# EAGLE design dodocohedreled (EAGLE 6.5.0)
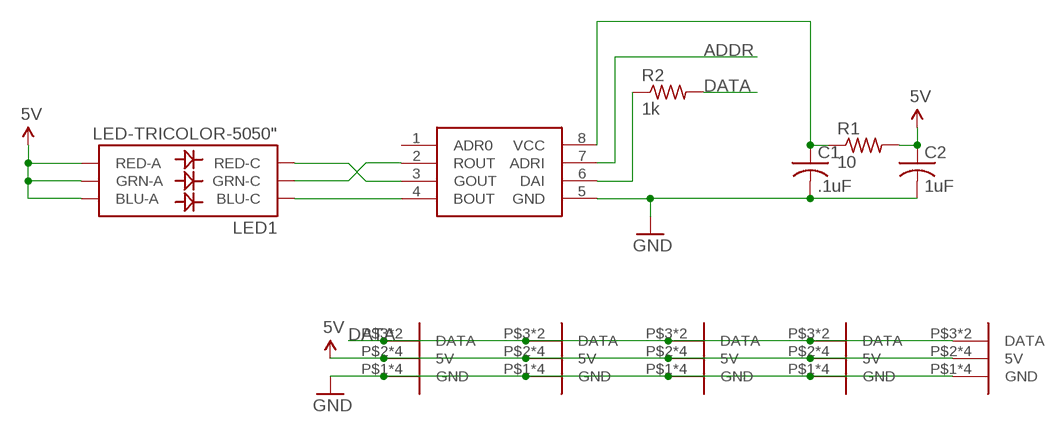
[diagram p0: schematic, sheet 1]

## Parts
C1  .1uF  C-USC0603  [C0603]
C2  1uF  C-USC0603  [C0603]
LED1  LED-TRICOLOR-5050"  [LED-TRICOLOR-5050-FIXED]
R1  10  R-US_R0603  [R0603]
R2  1k  R-US_R0603  [R0603]
U$1  WS2821A  [SOP8]
U$2  D_EDGESLOT  [D_EDGE_SLOT]
U$3  D_EDGESLOT  [D_EDGE_SLOT]
U$4  D_EDGESLOT  [D_EDGE_SLOT]
U$5  D_EDGESLOT  [D_EDGE_SLOT]
U$6  D_EDGESLOT  [D_EDGE_SLOT]

## Nets
5V: C2.1 LED1.4(GRN-A) LED1.5(RED-A) LED1.6(BLU-A) R1.2 U$2.P$2(5V) U$2.P$4(5V) U$2.P$7(5V) U$2.P$9(5V) U$3.P$2(5V) U$3.P$4(5V) U$3.P$7(5V) U$3.P$9(5V) U$4.P$2(5V) U$4.P$4(5V) U$4.P$7(5V) U$4.P$9(5V) U$5.P$2(5V) U$5.P$4(5V) U$5.P$7(5V) U$5.P$9(5V) U$6.P$2(5V) U$6.P$4(5V) U$6.P$7(5V) U$6.P$9(5V)
ADDR: U$1.7(ADRI)
DATA: R2.2 U$2.P$3(DATA) U$2.P$8(DATA) U$3.P$3(DATA) U$3.P$8(DATA) U$4.P$3(DATA) U$4.P$8(DATA) U$5.P$3(DATA) U$5.P$8(DATA) U$6.P$3(DATA) U$6.P$8(DATA)
GND: C1.2 C2.2 U$1.5(GND) U$2.P$1(GND) U$2.P$5(GND) U$2.P$6(GND) U$2.P$10(GND) U$3.P$1(GND) U$3.P$5(GND) U$3.P$6(GND) U$3.P$10(GND) U$4.P$1(GND) U$4.P$5(GND) U$4.P$6(GND) U$4.P$10(GND) U$5.P$1(GND) U$5.P$5(GND) U$5.P$6(GND) U$5.P$10(GND) U$6.P$1(GND) U$6.P$5(GND) U$6.P$6(GND) U$6.P$10(GND)
N$1: LED1.3(GRN-C) U$1.2(ROUT)
N$2: LED1.1(BLU-C) U$1.4(BOUT)
N$3: LED1.2(RED-C) U$1.3(GOUT)
N$6: C1.1 R1.1 U$1.8(VCC)
N$10: R2.1 U$1.6(DAI)
Unconnected: U$1.1(ADR0)

## Library data of the parts
C1 C2 = adafruit:C-US: CAPACITOR, American symbol
LED1 = blinkinlabs:LED-TRICOLOR-5050
R1 R2 = adafruit:R-US_: RESISTOR, American symbol
U$1 = dodocohedreled:WS2821A
U$2-U$6 = dodocohedreled:D_EDGE

## Board
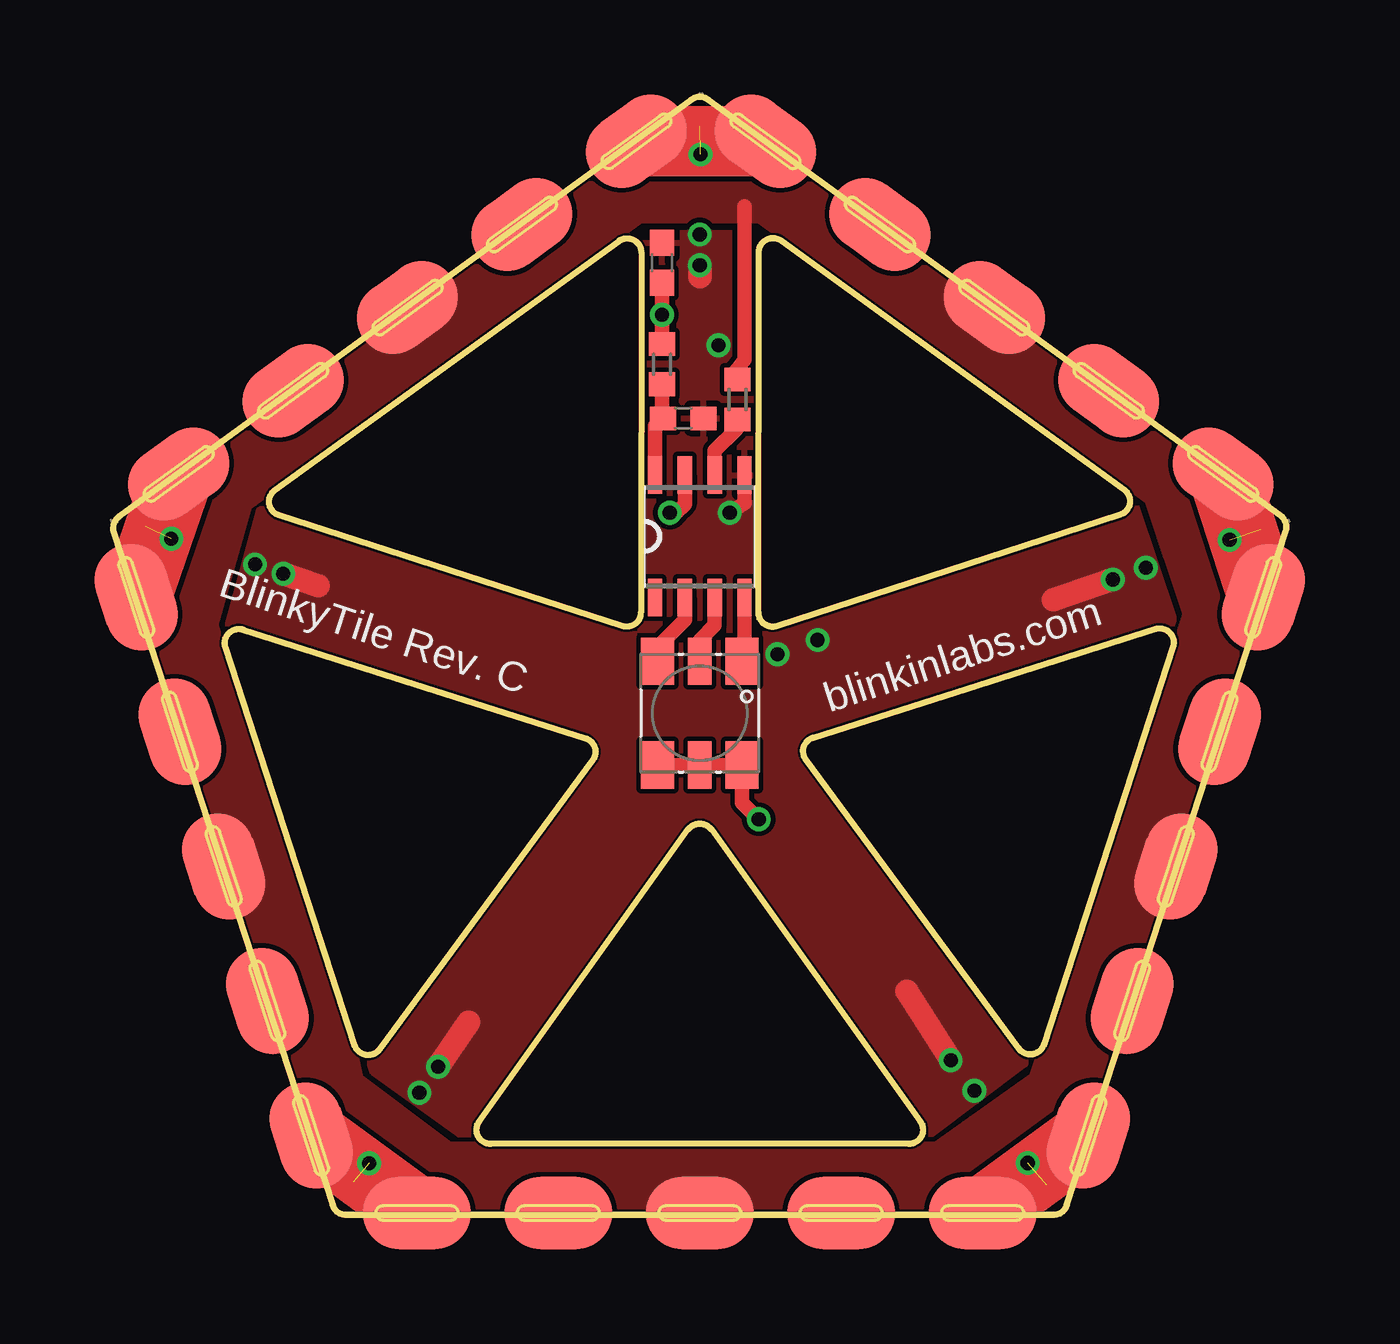
[diagram p1: board, top side]
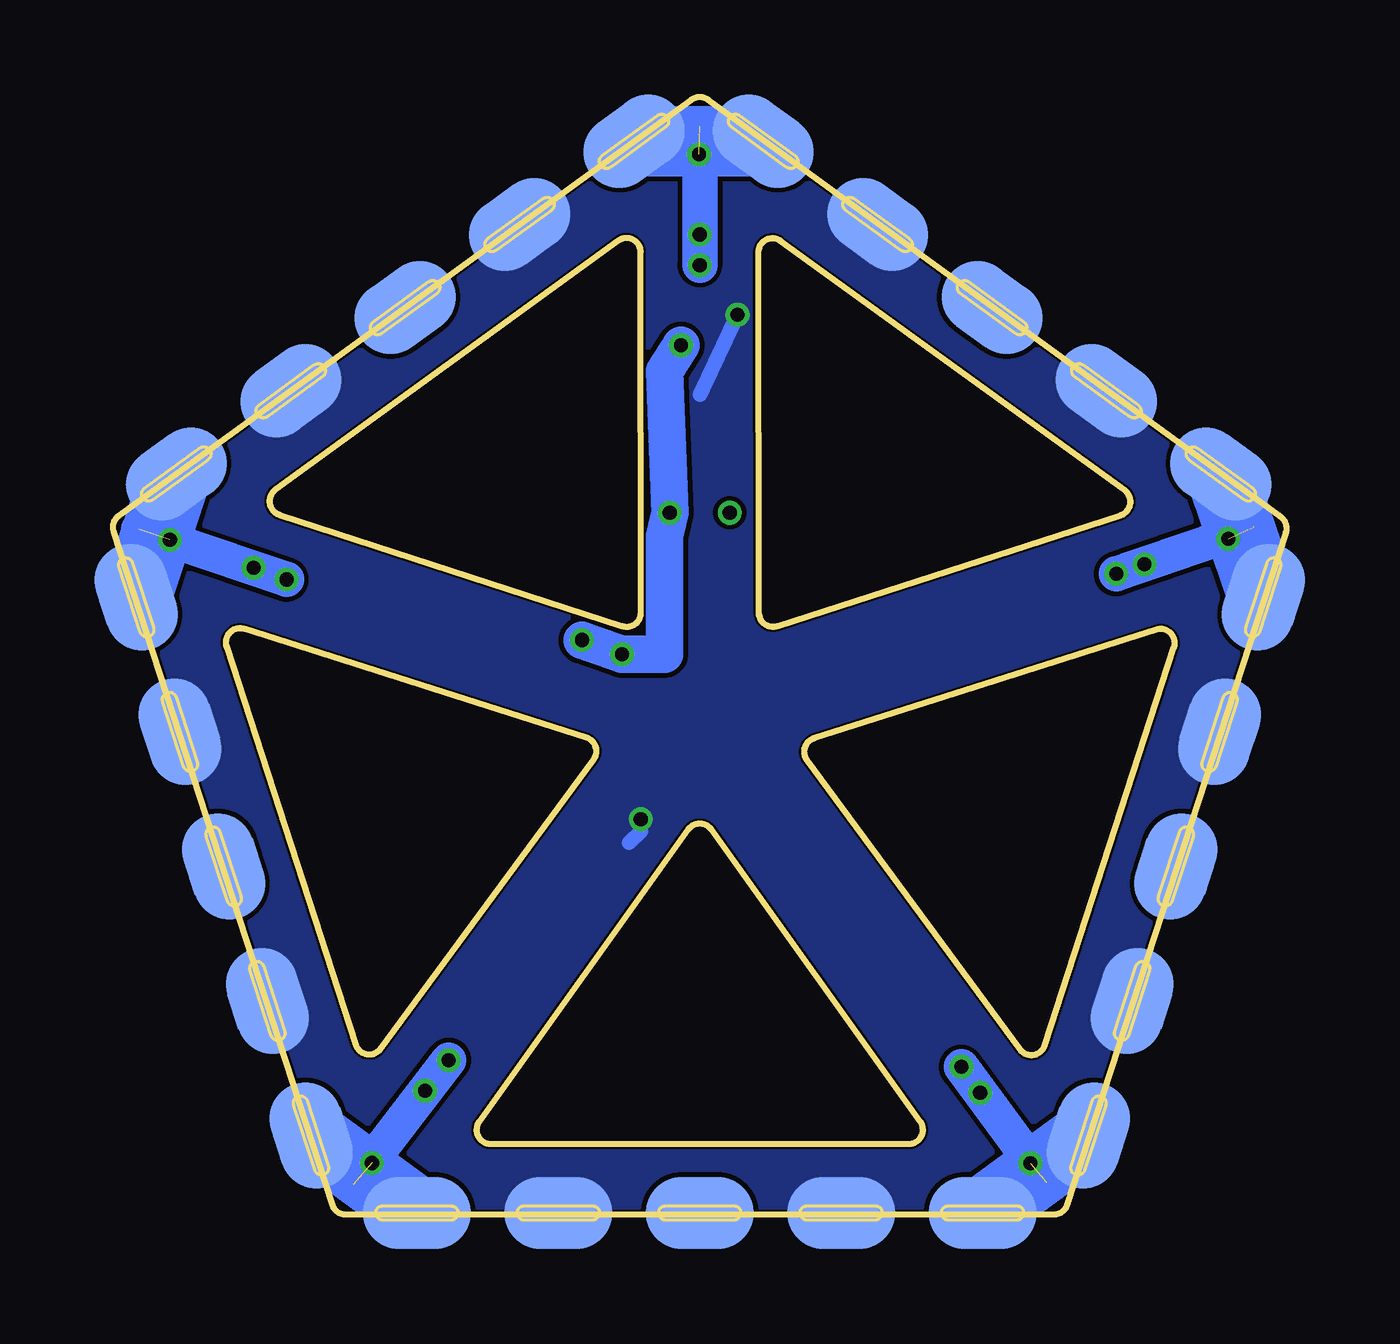
[diagram p2: board, bottom side, seen from below]

Size 49.79 x 47.41 mm. Coordinates in mm from the lower left corner, seen from the top.
Outline: 0.03,28.93 9.31,0.41 arc72 9.88,0 39.91,0 arc72 40.48,0.41 49.76,28.98 arc72 49.54,29.65 25.25,47.29 arc72 24.54,47.29 0.25,29.6 arc72 0.03,28.93
Outline: 15.53,3.95 24.41,16.34 arc-109 25.38,16.34 34.25,3.95 arc-126 33.77,3 16.02,3 arc-126 15.53,3.95
Outline: 38.44,7.04 29.4,19.3 arc-109 29.7,20.23 44.22,24.84 arc-126 44.97,24.08 39.49,7.21 arc-126 38.44,7.04
Outline: 5.52,24.81 20.05,20.2 arc-109 20.35,19.28 11.31,7.01 arc-126 10.25,7.18 4.77,24.06 arc-126 5.52,24.81
Outline: 22.41,40.81 22.39,25.54 arc-108 21.61,24.96 7.04,29.67 arc-126 6.87,30.73 21.46,41.3 arc-126 22.41,40.81
Outline: 42.74,29.69 28.18,24.96 arc-108 27.39,25.53 27.4,40.82 arc-126 28.35,41.31 42.9,30.75 arc-126 42.74,29.69
Copper layers (1*16): Top 0.035mm / dielectric 1.5mm / Bottom 0.035mm
Design rules "default *": minimum track width 10mil, minimum drill 0.6mm, track to track 8mil, track to pad 8mil, pad to pad 8mil, via to via 8mil, smd to smd 8mil, copper to edge 0.1mm, drill to drill 8mil, minimum pad ring 10mil, minimum via ring 8mil, stop-mask expansion 4mil, vias tented up to drill 0.6mm, thermal gap 10mil

### Footprints (pad centres in the part's own frame; a part is rotated, then mirrored left to right if it is on the bottom)
C0603 = smd 1.1 x 1: 1 -0.85,0; 2 0.85,0
LED-TRICOLOR-5050-FIXED = smd 2 x 1.4: 1 -2.2,1.8; 3 -2.2,-1.8; 4 2.2,-1.8; 6 2.2,1.8 | smd 2 x 1: 2 -2.2,0; 5 2.2,0
R0603 = smd 1 x 1.1: 1 -0.85,0; 2 0.85,0
SOP8 = smd 0.6 x 1.6: 1 -1.905,-2.6; 2 -0.635,-2.6; 3 0.635,-2.6; 4 1.905,-2.6; 5 1.905,2.6; 6 0.635,2.6; 7 -0.635,2.6; 8 -1.905,2.6
D_EDGE_SLOT = smd 4.572 x 3.048: P$1 -12,0; P$2 -6,0; P$3 0,0; P$4 6,0; P$5 12,0 | smd 4.572 x 3.048 bottom: P$6 -12,0; P$7 -6,0; P$8 0,0; P$9 6,0; P$10 12,0

### Placement (x,y rotation side)
C1  24.19,33.77 0 top
C2  23.29,40.37 90 top
LED1  24.89,21.27 270 top
R1  23.29,36.07 90 top
R2  26.49,34.57 90 top
U$1  24.89,28.77 0 top
U$2  24.89,0.07 0 top
U$3  45.09,14.77 72 top
U$4  4.69,14.77 288 top
U$5  37.39,38.47 144 top
U$6  12.49,38.47 216 top

### Tracks (layer width: path | path; a pad name or v marks a point on that pad's centre or on a via)
5V  (via drill 0.6)  (10 unrouted)
  Top 0.61: LED1.4 LED1.5 LED1.6 26.69,17.47 v27.39,16.77 | C2.1 v23.29,38.17 R1.2
  Bottom 0.61: v27.39,16.77 27.39,16.27 27.89,15.77 | v23.29,38.17 24.89,34.77
  pour Bottom: 9.44,0 -0.11,29.39 24.89,47.55 49.89,29.39 40.34,0
ADDR  (via drill 0.6)
  Top 0.61: v23.62,29.77 23.89,29.77 24.26,30.13 U$1.7
DATA  (5 unrouted)
  Top 0.61: R2.2 26.44,35.82 26.79,36.27 26.79,42.77
  pour Top: 9.49,0.07 40.39,-0.03 49.89,29.37 24.89,47.57 -0.11,29.27 7.59,5.57 10.32,6.75 4.34,25.01 5.78,30.03 22.39,42.17 27.39,42.17 43.89,30.27 45.49,25.47 38.99,5.87 34.89,2.97 14.29,2.97 10.29,5.97 7.89,4.67
GND  (via drill 0.6)  (10 unrouted)
  Top 0.61: U$1.5 26.8,30.17 v26.16,29.77
  Top 1: v24.89,40.27 24.89,39.77 | v42.42,26.94 39.89,26.07 | v35.54,6.55 33.69,9.47 | v13.79,6.27 15.09,8.17 | v7.22,27.18 8.69,26.67
  Top 3: U$6.P$6 U$5.P$10 | U$6.P$10 U$4.P$6 | U$4.P$10 U$2.P$6 | U$2.P$10 U$3.P$6 | U$5.P$6 U$3.P$10
  Bottom 1: U$6.P$6 24.89,46.17 | U$5.P$6 48.69,29.07 | U$2.P$10 39.59,1.27 | U$2.P$6 10.19,1.37 | U$6.P$10 1.39,29.17
  Bottom 1.5: 24.89,46.17 v24.89,40.27 | 48.69,29.07 v42.42,26.94 | 39.59,1.27 v35.54,6.55 | 10.19,1.37 v13.79,6.27 | 1.39,29.17 v7.22,27.18
  Bottom 1.6: v25.69,36.87 26.39,35.77 v26.16,29.77 26.39,28.77 26.39,23.77 v28.19,23.77 v29.89,24.37
  Bottom 3: U$4.P$10 U$2.P$6 | U$2.P$10 U$3.P$6 | U$3.P$10 U$5.P$6 | U$5.P$10 U$6.P$6 | U$4.P$6 U$6.P$10
  other vias: 24.89,41.57 43.82,27.44 36.54,5.25 12.99,5.17 6.02,27.58 10.86,2.18 2.47,28.67 24.92,44.97 47.37,28.62 38.8,2.19
  pour Top: 11.04,6 4.79,24.76 6.19,29.88 22.39,41.67 27.39,41.65 43.39,30.07 45.01,25.27 38.69,6.37 34.74,3.4 14.69,3.37
N$1
  Top 0.61: U$1.2 24.26,25.23 23.09,24.07 LED1.3
N$2
  Top 0.61: U$1.4 26.8,23.57 LED1.1
N$3
  Top 0.61: U$1.3 25.53,25 24.89,24.37 LED1.2
N$4
  pour Top: 7.89,7.27 10.04,7.98 10.54,5.48 8.39,3.77
N$6
  Top 0.61: U$1.8 22.99,33.47 C1.1 23.29,33.87 R1.1
N$10
  Top 0.61: R2.1 26.44,33.32 25.53,32.41 U$1.6

### Text on the board
tNames: BlinkyTile Rev. C | blinkinlabs.com